# Altium schematic sheet power.SchDoc
size A4; SheetNumber: 2; SheetTotal: 3
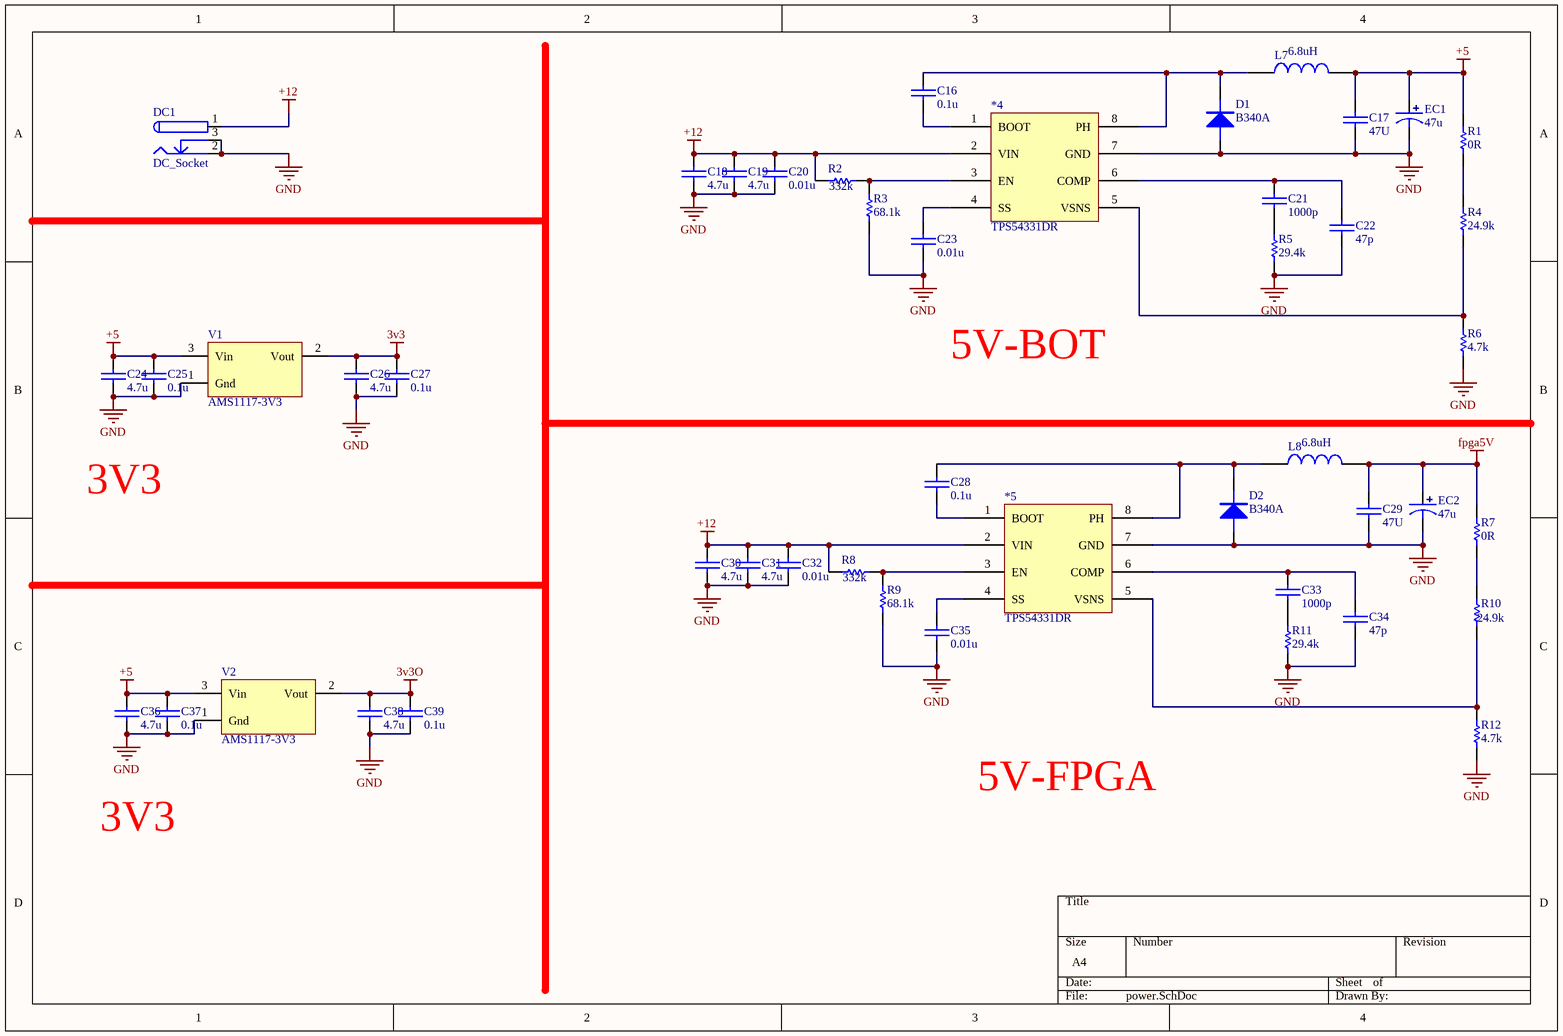
[diagram p0: power.SchDoc]

## Parts
*4  TPS54331DR  [SOIC-8]
*5  TPS54331DR  [SOIC-8]
C16  0.1u  [0603C]
C17  47U  [0603C]
C18  4.7u  [0603C]
C19  4.7u  [0603C]
C20  0.01u  [0603C]
C21  1000p  [0603C]
C22  47p  [0603C]
C23  0.01u  [0603C]
C24  4.7u  [0603C]
C25  0.1u  [0603C]
C26  4.7u  [0603C]
C27  0.1u  [0603C]
C28  0.1u  [0603C]
C29  47U  [0603C]
C30  4.7u  [0603C]
C31  4.7u  [0603C]
C32  0.01u  [0603C]
C33  1000p  [0603C]
C34  47p  [0603C]
C35  0.01u  [0603C]
C36  4.7u  [0603C]
C37  0.1u  [0603C]
C38  4.7u  [0603C]
C39  0.1u  [0603C]
D1  B340A  [SMA/DO-214AC]
D2  B340A  [SMA/DO-214AC]
DC1  DC_Socket  [DC-005]
EC1  47u  [SMD-EC6.3X6.3X10]
EC2  47u  [SMD-EC6.3X6.3X10]
L7  6.8uH  [L-SMD-0630]
L8  6.8uH  [L-SMD-0630]
R1  0R  [0603R]
R2  332k  [0603R]
R3  68.1k  [0603R]
R4  24.9k  [0603R]
R5  29.4k  [0603R]
R6  4.7k  [0603R]
R7  0R  [0603R]
R8  332k  [0603R]
R9  68.1k  [0603R]
R10  24.9k  [0603R]
R11  29.4k  [0603R]
R12  4.7k  [0603R]
V1  AMS1117-3V3  [SOT223_L]
V2  AMS1117-3V3  [SOT223_L]

## Nets
3v3: C26.2 C27.2 V1.2(Vout)
3v3O: C38.2 C39.2 V2.2(Vout)
+5: C17.2 C24.2 C25.2 C36.2 C37.2 EC1.1 L7.2 R1.2 V1.3(Vin) V2.3(Vin)
+12: *4.2(VIN) *5.2(VIN) C18.2 C19.2 C20.2 C30.2 C31.2 C32.2 DC1.1 R2.2 R8.2
fpga5V: C29.2 EC2.1 L8.2 R7.2
GND: *4.7(GND) *5.7(GND) C17.1 C18.1 C19.1 C20.1 C22.1 C23.1 C24.1 C25.1 C26.1 C27.1 C29.1 C30.1 C31.1 C32.1 C34.1 C35.1 C36.1 C37.1 C38.1 C39.1 D1.A D2.A DC1.2 DC1.3 EC1.2 EC2.2 R3.1 R5.1 R6.1 R9.1 R11.1 R12.1 V1.1(Gnd) V2.1(Gnd)
Net*4_1: *4.1(BOOT) C16.1
Net*4_3: *4.3(EN) R2.1 R3.2
Net*4_4: *4.4(SS) C23.2
Net*4_5: *4.5(VSNS) R4.1 R6.2
Net*4_6: *4.6(COMP) C21.2 C22.2
Net*4_8: *4.8(PH) C16.2 D1.K L7.1
Net*5_1: *5.1(BOOT) C28.1
Net*5_3: *5.3(EN) R8.1 R9.2
Net*5_4: *5.4(SS) C35.2
Net*5_5: *5.5(VSNS) R10.1 R12.2
Net*5_6: *5.6(COMP) C33.2 C34.2
Net*5_8: *5.8(PH) C28.2 D2.K L8.1
NetC21_1: C21.1 R5.2
NetC33_1: C33.1 R11.2
NetR1_1: R1.1 R4.2
NetR7_1: R7.1 R10.2

## Notes on the sheet
- 5V-BOT
- 3V3
- 5V-FPGA

## Library data of the parts
*4 *5 = TPS54331DR: 降压型DC-DC
C16-C39 = CAP: 无极性电容
D1 D2 = DIODE: 普通二极管
EC1 EC2 = ECAP: 贴片电解电容
L7 L8 = L: INDUCTOR
R1-R12 = RES: 电阻
V1 V2 = AMS1117: LDO; BOM名称: 稳压芯片; 封装库来自淘宝卖家：黄晶宝石: 其他店铺购入的买家，请立即申请退款，本店现金奖励200~1000元